# Altium schematic sheet RFLNA.SchDoc: RF LNA
size Legal; CheckedBy: J. Brinton; CompanyName: Signal Laboratories, Inc.; DrawnBy: J. Brinton; Engineer: J. Brinton; Address1: 3479 Edison Way; Address2: Menlo Park CA 94025; Address3: +1 (877) 778-8435; Address4: siglabs.com; DocumentNumber: 52; Revision: 2b; SheetNumber: 53; SheetTotal: 58
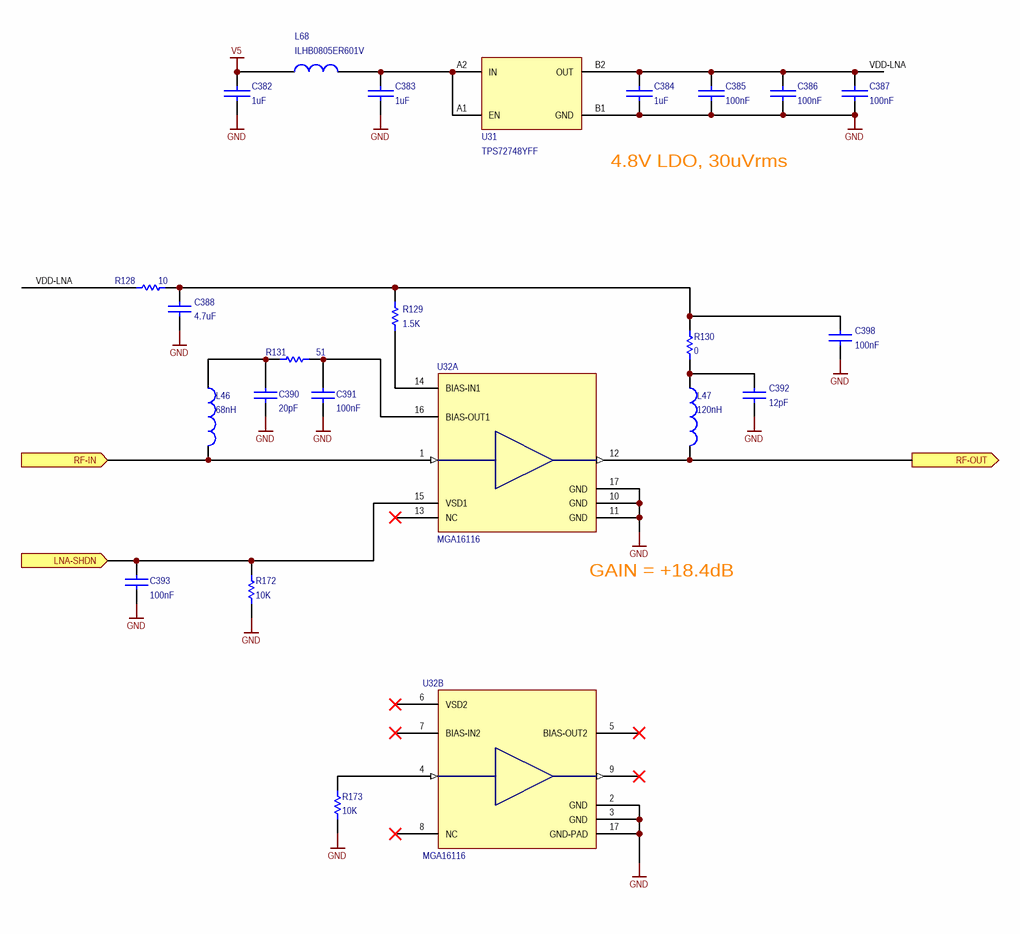
[diagram p0: RFLNA.SchDoc]

## Parts
C382  value 1uF  [0402]  (hidden comment: GRM155R61A105KE15D)
C383  value 1uF  [0402]  (hidden comment: GRM155R61A105KE15D)
C384  value 1uF  [0402]  (hidden comment: GRM155R61A105KE15D)
C385  value 100nF  [0402]  (hidden comment: GRM155R71C104KA88J)
C386  value 100nF  [0402]  (hidden comment: GRM155R71C104KA88J)
C387  value 100nF  [0402]  (hidden comment: GRM155R71C104KA88J)
C388  value 4.7uF  [0603]  (hidden comment: CL10A475KA8NQNC)
C390  value 20pF  [0402]  (hidden comment: CBR04C200F5GAC)
C391  value 100nF  [0402]  (hidden comment: GRM155R71C104KA88J)
C392  value 12pF  [0402]  (hidden comment: CBR04C120F5GAC)
C393  value 100nF  [0402]  (hidden comment: GRM155R71C104KA88J)
C398  value 100nF  [0402]  (hidden comment: GRM155R71C104KA88J)
L46  value 68nH  [0402]  (hidden comment: LQW15AN68NG00D)
L47  value 120nH  [0402]  (hidden comment: LQW15ANR12J00D)
L68  ILHB0805ER601V  [0805]
R128  value 10  [0603]  (hidden comment: RC0603FR-0710RL)
R129  value 1.5K  [0603]  (hidden comment: RC0603FR-071K5L)
R130  value 0  [0603]  (hidden comment: ERJ-3GEY0R00V)
R131  value 51  [0402]  (hidden comment: ERJ-2RKF51R0X)
R172  value 10K  [0402]  (hidden comment: ERJ-2RKF1002X)
R173  value 10K  [0402]  (hidden comment: ERJ-2RKF1002X)
U31  TPS72748YFF  [DSBGA-4]
U32  MGA16116  [QFN-16-AVAGO]  (parts A,B of 2)

## Ports
LNA-SHDN (in), RF-IN (in), RF-OUT (out)

## Nets
GND: C382.1 C383.1 C384.1 C385.1 C386.1 C387.1 C388.1 C390.2 C391.1 C392.1 C393.1 C398.1 R172.1 R173.1 U31.B1(GND) U32.2(GND) U32.3(GND) U32.10(GND) U32.11(GND) U32.17(GND)
V5: C382.2 L68.2
LNA-SHDN: C393.2 R172.2 U32.15(VSD1) ; port LNA-SHDN
RF-IN: L46.2 U32.1(RFIN1) ; port RF-IN
RF-OUT: L47.2 U32.12(RFOUT1) ; port RF-OUT
VDD-LNA: C384.2 C385.2 C386.2 C387.2 R128.1 U31.B2(OUT)
NetC383_2: C383.2 L68.1 U31.A1(EN) U31.A2(IN)
NetC388_2: C388.2 C398.2 R128.2 R129.2 R130.2
NetC390_1: C390.1 L46.1 R131.1
NetC391_2: C391.2 R131.2 U32.16(BIAS-OUT1)
NetC392_2: C392.2 L47.1 R130.1
NetR129_1: R129.1 U32.14(BIAS-IN1)
NetR173_2: R173.2 U32.4(RFIN2)

Not connected (* = marked no-connect by the designer): U32 5(BIAS-OUT2)* 6(VSD2)* 7(BIAS-IN2)* 8(NC)* 9(RFOUT2)* 13(NC)*

## Notes on the sheet
- 4.8V LDO, 30uVrms
- (near U32) GAIN = +18.4dB
- Title
- Engineer
- Revision
- Drawn By
- Checked By
- Date
- Sheet
- of

## Library data of the parts
C382-C384 = CAP: Ceramic Capacitor 1uF ±10% 10V X5R 0402; Manufacturer: Murata; Tr: -55:125; Manufacturer P/N: GRM155R61A105KE15D; Package: 0402; Tolerance: ±10%; Voltage: 10V
C385-C387 = CAP: Ceramic Capacitor 100nF ±10% 16V X7R 0402; Manufacturer: Murata; Tr: -55:125; Manufacturer P/N: GRM155R71C104KA88J; Voltage: 16V; Package: 0402; Tolerance: ±10%
C388 = CAP 0603: Ceramic Capacitor 4.7uF ±10% 25V X5R 0603; Manufacturer: Samsung; Tr: -55:85; Voltage: 25V; Manufacturer P/N: CL10A475KA8NQNC; Package: 0603; Do Not Place: *; Tolerance: ±10%
C390 = CAP 0402: Ceramic Capacitor 20pF ±1% 50V NP0 0402; Manufacturer: Kemet; Tr: -55:125; Voltage: 50V; Manufacturer P/N: CBR04C200F5GAC; Package: 0402; Tolerance: ±1%
C391 C393 C398 = CAP 0402: Ceramic Capacitor 100nF ±10% 16V X7R 0402; Manufacturer: Murata; Tr: -55:125; Voltage: 16V; Manufacturer P/N: GRM155R71C104KA88J; Package: 0402; Do Not Place: *; Tolerance: ±10%
C392 = CAP 0402: Ceramic Capacitor 12pF ±1% 50V NP0 0402; Manufacturer: Kemet; Tr: -55:125; Voltage: 50V; Manufacturer P/N: CBR04C120F5GAC; Package: 0402; Do Not Place: *; Tolerance: ±1%
L46 = INDUCTOR: Inductor Wirewound 68nH ±5% 0402; Manufacturer: Murata; Tolerance: ±2%; Tr: -55:125; Manufacturer P/N: LQW15AN68NG00D; Package: 0402
L47 = INDUCTOR: Inductor Wirewound 120nH ±5% 0402; Manufacturer: Murata; Tr: -55:125; Manufacturer P/N: LQW15ANR12J00D; Package: 0402; Tolerance: ±5%
L68 = INDUCTANCE1: Ferrite Bead 600-Ohm @ 100MHz 2A 0805; Manufacturer: Vishay Dale; Value: 600@100MHz; Tolerance: ±25%; Tr: -55:125; Manufacturer P/N: ILHB0805ER601V; Package: 0805
R128 = RES 0603: Thick Film Resistor 10 ±1% 0603; Manufacturer: Yageo; Tr: -55:155; Package: 0603; Manufacturer P/N: RC0603FR-0710RL; Do Not Place: *; Tolerance: ±1%
R129 = RES 0603: Thick Film Resistor 1.5k ±1% 0603; Manufacturer: Yageo; Tr: -55:155; Package: 0603; Manufacturer P/N: RC0603FR-071K5L; Do Not Place: *; Tolerance: ±1%
R130 = RES 0603: Thick Film Resistor Jumper 0603; Manufacturer: Panasonic; Tr: -55:155; Package: 0603; Manufacturer P/N: ERJ-3GEY0R00V; Do Not Place: *; Tolerance: 0
R131 = RES 0402: Thick Film Resistor 51 ±1% 0402; Manufacturer: Panasonic; Tr: -55:155; Package: 0402; Manufacturer P/N: ERJ-2RKF51R0X; Do Not Place: *; Tolerance: ±1%
R172 R173 = RES 0402: Thick Film 10k ±1% 0402; Manufacturer: Panasonic; Tr: -55:155; Package: 0402; Manufacturer P/N: ERJ-2RKF1002X; Tolerance: ±1%
U31 = TPS72748YFF: Ultralow Noise 30uVrms LDO, Fixed, 4.8V, 200mA; Manufacturer: Texas Instruments; Manufacturer P/N: TPS72748YFF
U32 = MGA-16116: Dual Amplifier, Ultra-Low-Noise, 450-1450MHz; Manufacturer: Avago; Manufacturer P/N: MGA16116